# EAGLE design mainboard (EAGLE 7.7.0)
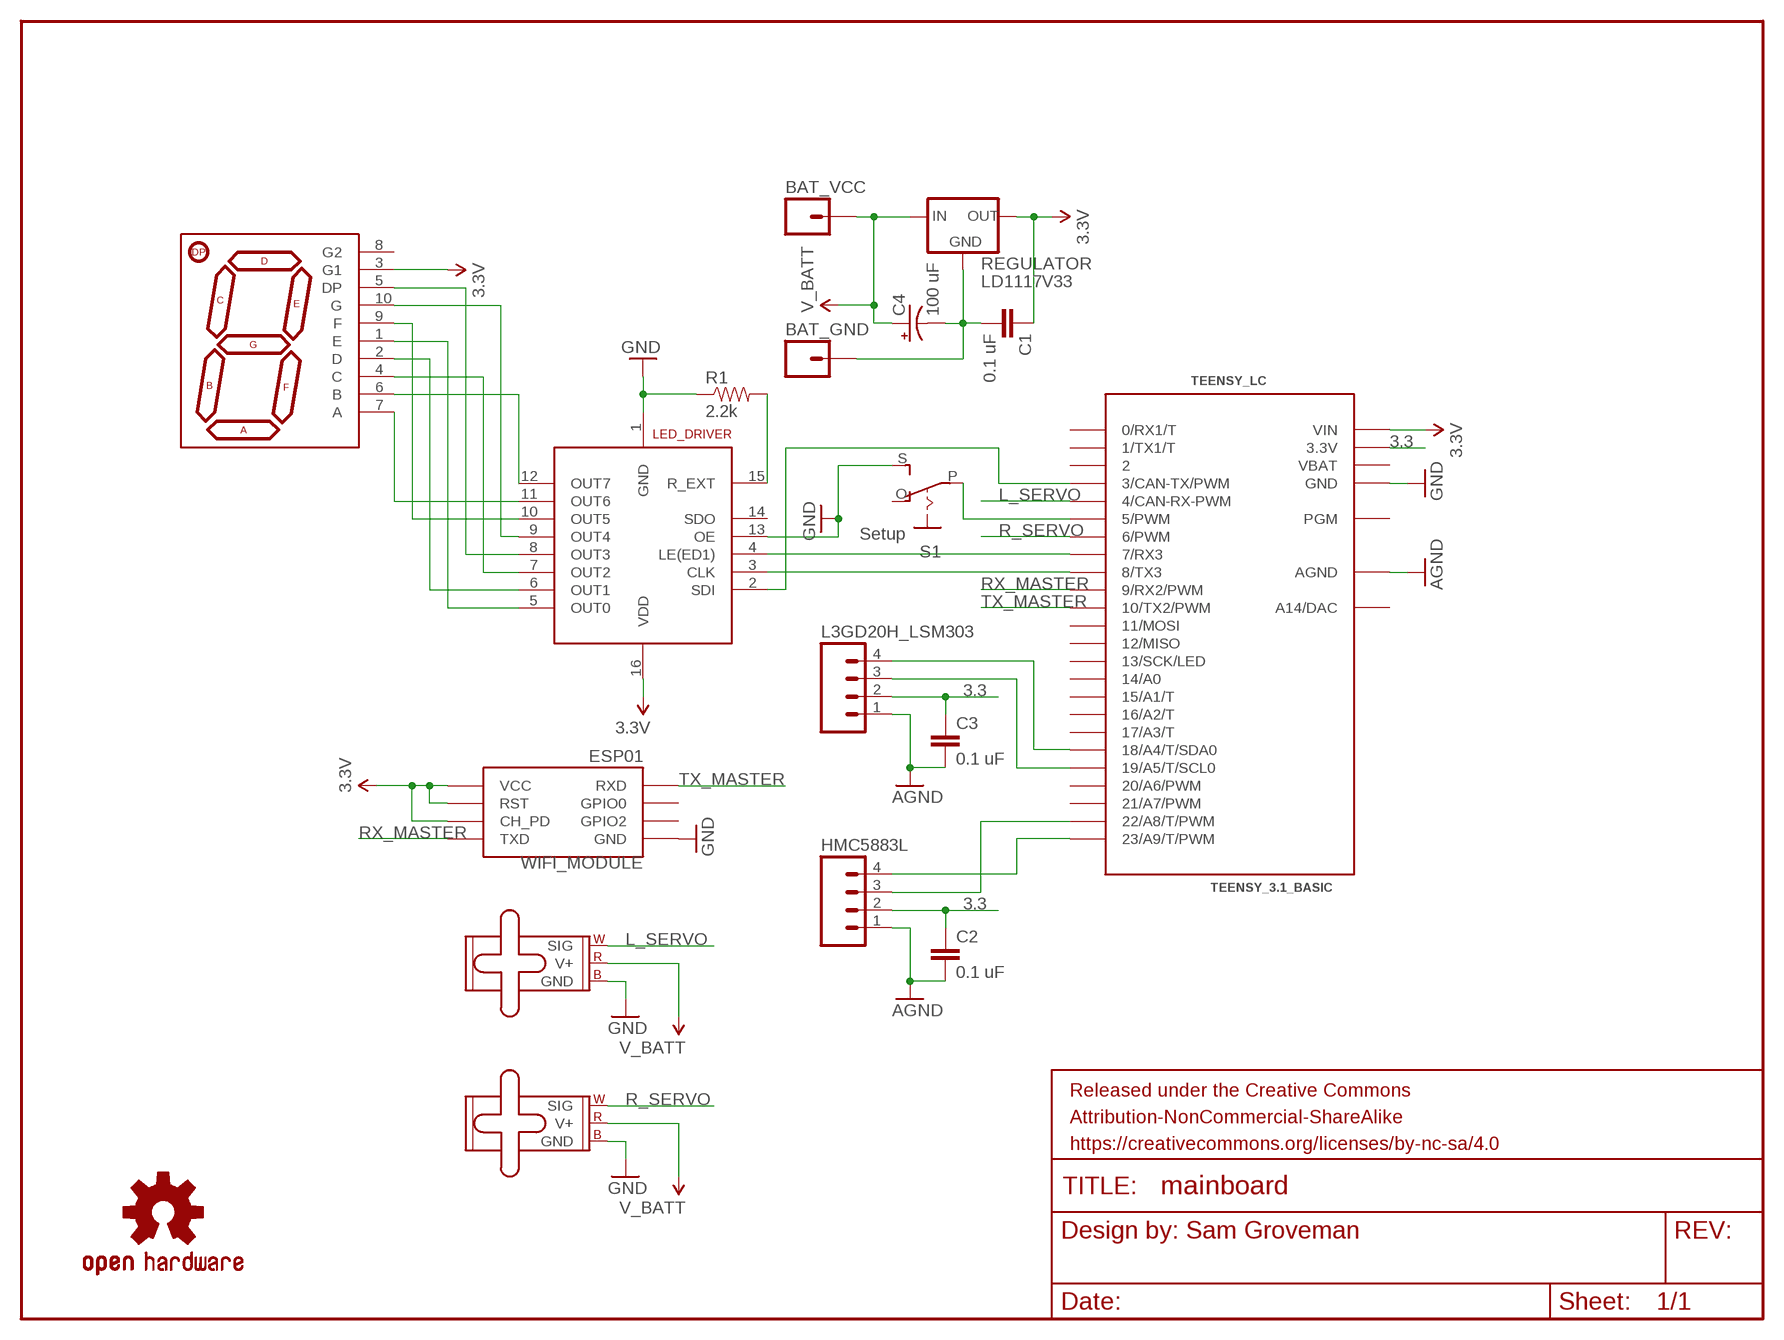
[diagram p0: schematic, sheet 1]

## Parts
BAT_GND  M01PTH  [1X01]
BAT_VCC  M01PTH  [1X01]
C1  0.1 uF  CAPPTH  [CAP-PTH-SMALL]
C2  0.1 uF  CAPPTH  [CAP-PTH-SMALL]
C3  0.1 uF  CAPPTH  [CAP-PTH-SMALL]
C4  100 uF  CAP_POLPTH1  [CPOL-RADIAL-100UF-25V]
FRAME1  FRAME-LETTER  [CREATIVE_COMMONS]
HMC5883L  M04PTH  [1X04]
L3GD20H_LSM303  M04PTH  [1X04]
L_SERVO  SMALL_SERVO  [1X03]
LED_DRIVER  TLC5916/17DIP-16  [DIP-16]
LOGO1  OSHW-LOGOL  [OSHW-LOGO-L]
R1  2.2k  RESISTORPTH-1/4W  [AXIAL-0.4]
R_SERVO  SMALL_SERVO  [1X03]
REGULATOR  LD1117V33  [LD1117V33]
S1  Setup  EG1218S  [EG1218]
TEENSY_LC  TEENSY_3.1_BASIC  [TEENSY_3.1_BASIC]
U$4  7-SEGMENT-DISPLAY-1"-RED  [7-SEGMENT-1"PTH]
WIFI_MODULE  ESP01  [ESP01]

## Nets
3.3: C2.1 C3.1 HMC5883L.2 L3GD20H_LSM303.2 TEENSY_LC.3.3V TEENSY_LC.3.3V1(3.3V)
3.3V: C1.1 LED_DRIVER.16(VDD) REGULATOR.OUT TEENSY_LC.VIN U$4.3(G1) WIFI_MODULE.CH_PD WIFI_MODULE.RST WIFI_MODULE.VCC
AGND: C2.2 C3.2 HMC5883L.1 L3GD20H_LSM303.1 TEENSY_LC.AGND
CLK: LED_DRIVER.3(CLK) TEENSY_LC.8(8/TX3)
F_SCL: HMC5883L.3 TEENSY_LC.22/A8(22/A8/T/PWM)
F_SDA: HMC5883L.4 TEENSY_LC.23/A9(23/A9/T/PWM)
GND: BAT_GND.1 C1.2 C4.2(-) L_SERVO.3(GND) LED_DRIVER.1(GND) LED_DRIVER.13(OE) R1.P$1 R_SERVO.3(GND) REGULATOR.GND S1.S TEENSY_LC.GND TEENSY_LC.GND1(GND) WIFI_MODULE.GND
L_SERVO: L_SERVO.1(SIG) TEENSY_LC.4(4/CAN-RX-PWM)
LE: LED_DRIVER.4(LE(ED1)) TEENSY_LC.7(7/RX3)
LED_1: LED_DRIVER.5(OUT0) U$4.1(E)
LED_2: LED_DRIVER.6(OUT1) U$4.2(D)
LED_4: LED_DRIVER.7(OUT2) U$4.4(C)
LED_5: LED_DRIVER.8(OUT3) U$4.5(DP)
LED_6: LED_DRIVER.12(OUT7) U$4.6(B)
LED_7: LED_DRIVER.11(OUT6) U$4.7(A)
LED_9: LED_DRIVER.10(OUT5) U$4.9(F)
LED_10: LED_DRIVER.9(OUT4) U$4.10(G)
R_EXT: LED_DRIVER.15(R_EXT) R1.P$2
R_SCL: L3GD20H_LSM303.3 TEENSY_LC.19/A5(19/A5/T/SCL0)
R_SDA: L3GD20H_LSM303.4 TEENSY_LC.18/A4(18/A4/T/SDA0)
R_SERVO: R_SERVO.1(SIG) TEENSY_LC.6(6/PWM)
RX_MASTER: TEENSY_LC.9(9/RX2/PWM) WIFI_MODULE.TX(TXD)
SDI: LED_DRIVER.2(SDI) TEENSY_LC.3(3/CAN-TX/PWM)
SETUP: S1.P TEENSY_LC.5(5/PWM)
TX_MASTER: TEENSY_LC.10(10/TX2/PWM) WIFI_MODULE.RX(RXD)
V_BATT: BAT_VCC.1 C4.1(+) L_SERVO.2(V+) R_SERVO.2(V+) REGULATOR.IN
Unconnected: LED_DRIVER.14(SDO) S1.O TEENSY_LC.0(0/RX1/T) TEENSY_LC.1(1/TX1/T) TEENSY_LC.2 TEENSY_LC.11(11/MOSI) TEENSY_LC.12(12/MISO) TEENSY_LC.13(13/SCK/LED) TEENSY_LC.14/A0 TEENSY_LC.15/A1(15/A1/T) TEENSY_LC.16/A2(16/A2/T) TEENSY_LC.17/A3(17/A3/T) TEENSY_LC.20/A6(20/A6/PWM) TEENSY_LC.21/A7(21/A7/PWM) TEENSY_LC.A14(A14/DAC) TEENSY_LC.PGM U$4.8(G2) WIFI_MODULE.GPIO0 WIFI_MODULE.GPIO2

## Power pins joined to a net without a drawn wire
VBAT: TEENSY_LC.VBAT

## Library data of the parts
BAT_GND BAT_VCC = SparkFun-Connectors:M01: Header 1 Standard 1-pin 0.1" header. Use with straight break away headers (SKU : PRT-00116), right angle break away headers (PRT-00553), swiss pins (PRT-00743), machine pins (PRT-00117), and female headers (PRT-00115).
C1-C3 = SparkFun-Passives:CAP: Capacitor Standard 0603 ceramic capacitor, and 0.1" leaded capacitor.
C4 = SparkFun-Passives:CAP_POL: Capacitor Polarized These are standard SMD and PTH capacitors. Normally 10uF, 47uF, and 100uF in electrolytic and tantalum varieties. Always verify the external diameter of the through hole cap, it varies with capacity, voltage, and manufacturer. The EIA devices should be standard.
FRAME1 = SparkFun-Aesthetics:FRAME-LETTER: Schematic Frame Standard 8.5x11 US Letter frame
HMC5883L L3GD20H_LSM303 = SparkFun-Connectors:M04: Header 4 Standard 4-pin 0.1" header. Use with straight break away headers (SKU : PRT-00116), right angle break away headers (PRT-00553), swiss pins (PRT-00743), machine pins (PRT-00117), and female headers (PRT-00115). Molex polarized connector foot print use with SKU : PRT-08231 with associated crimp pins and housings. 1MM SMD Version SKU: PRT-10208
L_SERVO R_SERVO = SparkFun-Electromechanical:SMALL_SERVO: Small servo motor This is the small servo used in the SIK. SKU: ROB-09065
LED_DRIVER = BillPorter:TLC5916/17: TLC5916/17 8-Channel Constant-Current LED Sink Driver and Shift Register in one. Great for driving high current LEDs that would kill a 595 shift register. Specs @ http://focus.ti.com/docs/prod/folders/print/tlc5916.html
LOGO1 = SparkFun-Aesthetics:OSHW-LOGO: Open Source Hardware Logo This logo indicates the piece of hardware it is found on incorporates a OSHW license and/or adheres to the definition of open source hardware found here: http://freedomdefined.org/OSHW
R1 = SparkFun-Passives:RESISTOR: Resistor Basic schematic elements and footprints for 0603, 1206, and PTH resistors.
REGULATOR = LD1117V33:LD1117V33
S1 = adafruit:EG1218: SLIDING SWITCH 0.1" spacing through hole, vertical SPDT slide switch http://www.ladyada.net/library/pcb/eaglelibrary.html
TEENSY_LC = Teensy_3_Series_Board_v1.0:TEENSY_3.1_BASIC: Footprint for Teensy 3.1 board using all pin connections on the outer perimeter
U$4 = SparkFun-Displays:7-SEGMENT-DISPLAY-1"-RED: 7-Segment Display 1" Red (COM-08546) EZ is for kits. Pads are only exposed on the bottom side to help prevent soldering in upside down.
WIFI_MODULE = esp8266modules:ESP01: ESP8266 Wifi module 01

## Board
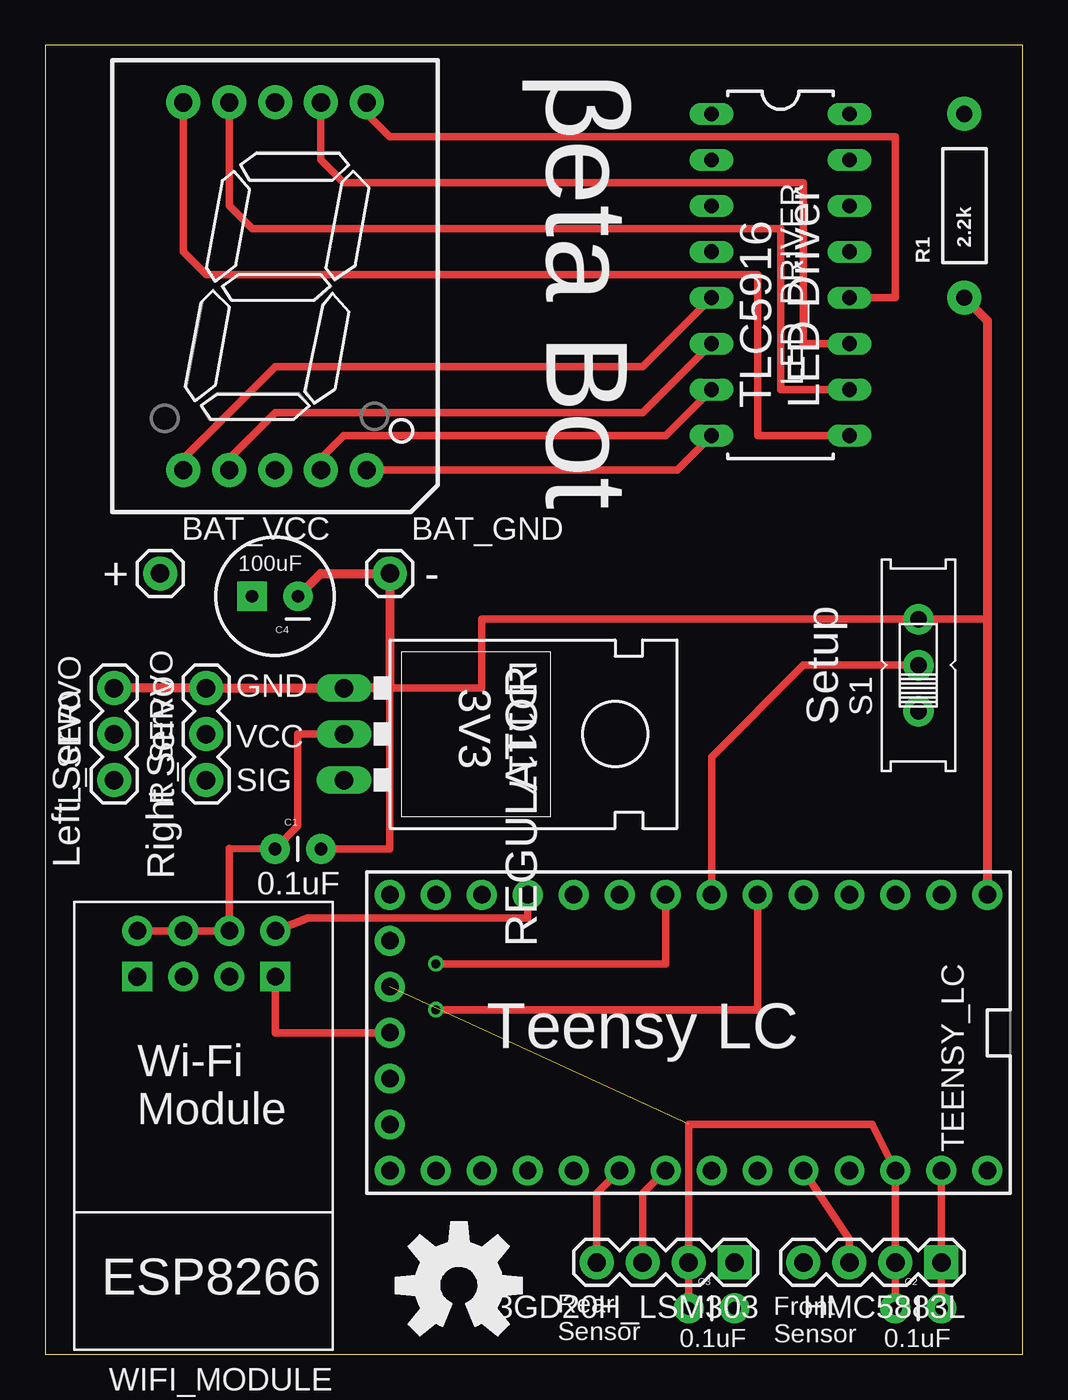
[diagram p1: board, top side]
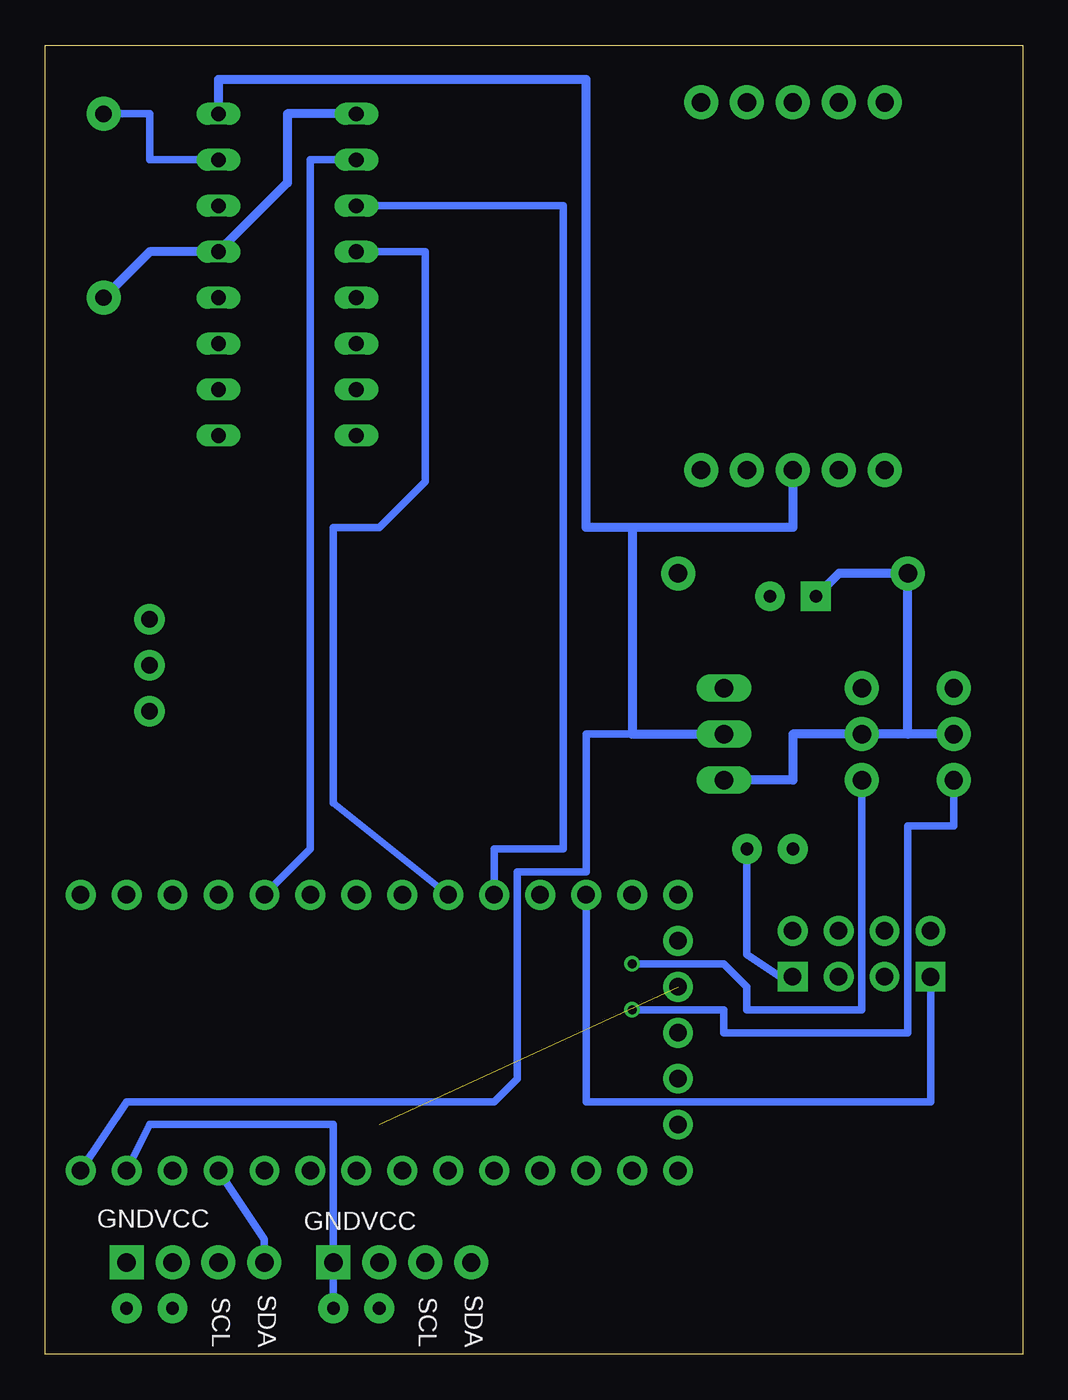
[diagram p2: board, bottom side, seen from below]

Size 54.03 x 72.38 mm. Coordinates in mm from the lower left corner, seen from the top.
Outline: 0,0 54.03,0 54.03,72.38 0,72.38 0,0
Copper layers (1*16): Top 0.0356mm / dielectric 1.5011mm / Bottom 0.0356mm
Design rules "oshpark-2layer *": minimum track width 6mil, minimum drill 13mil, track to track 6mil, track to pad 6mil, pad to pad 6mil, via to via 6mil, smd to smd 6mil, copper to edge 15mil, drill to drill 6mil, minimum pad ring 7mil, minimum via ring 7mil, stop-mask expansion 2.5mil, vias tented up to drill 35mil, thermal gap 10mil

### Footprints (pad centres in the part's own frame; a part is rotated, then mirrored left to right if it is on the bottom)
1X01 = drill 1.016 pad 1.88: 1 0,0
CAP-PTH-SMALL = drill 0.7 pad 1.651: 1 0,0; 2 2.54,0
CPOL-RADIAL-100UF-25V = drill 0.7 pad 1.651 square: 1 1.27,0 | drill 0.7 pad 1.651: 2 -1.27,0
1X04 = drill 1.016 pad 1.88 square: 1 0,0 | drill 1.016 pad 1.88: 2 2.54,0; 3 5.08,0; 4 7.62,0
1X03 = drill 1.016 pad 1.88: 1 0,0; 2 2.54,0; 3 5.08,0
DIP-16 = drill 0.813 long: 1 -8.89,-3.81; 2 -6.35,-3.81; 3 -3.81,-3.81; 4 -1.27,-3.81; 5 1.27,-3.81; 6 3.81,-3.81; 7 6.35,-3.81; 8 8.89,-3.81; 9 8.89,3.81; 10 6.35,3.81; 11 3.81,3.81; 12 1.27,3.81; 13 -1.27,3.81; 14 -3.81,3.81; 15 -6.35,3.81; 16 -8.89,3.81
AXIAL-0.4 = drill 0.9 pad 1.88: P$1 -5.08,0; P$2 5.08,0
LD1117V33 = drill 1.016 long: GND -2.54,-8.89; IN 2.54,-8.89; OUT 0,-8.89
EG1218 = drill 0.9 pad 1.676: O -2.54,0; P 0,0; S 2.54,0
TEENSY_3.1_BASIC = drill 0.965 pad 1.651: 0 -7.62,13.97; 1 -7.62,11.43; 2 -7.62,8.89; 3 -7.62,6.35; 3.3V 7.62,11.43; 3.3V1 -2.54,-16.51; 4 -7.62,3.81; 5 -7.62,1.27; 6 -7.62,-1.27; 7 -7.62,-3.81; 8 -7.62,-6.35; 9 -7.62,-8.89; 10 -7.62,-11.43; 11 -7.62,-13.97; 12 -7.62,-16.51; 13 7.62,-16.51; 14/A0 7.62,-13.97; 15/A1 7.62,-11.43; 16/A2 7.62,-8.89; 17/A3 7.62,-6.35; 18/A4 7.62,-3.81; 19/A5 7.62,-1.27; 20/A6 7.62,1.27; 21/A7 7.62,3.81; 22/A8 7.62,6.35; 23/A9 7.62,8.89; A14 5.08,-16.51; AGND 7.62,13.97; GND -7.62,16.51; GND1 0,-16.51; PGM 2.54,-16.51; VBAT -5.08,-16.51; VIN 7.62,16.51
7-SEGMENT-1"PTH = drill 1 pad 1.88: 1 -5.08,-10.16; 2 -2.54,-10.16; 3 0,-10.16; 4 2.54,-10.16; 5 5.08,-10.16; 6 5.08,10.16; 7 2.54,10.16; 8 0,10.16; 9 -2.54,10.16; 10 -5.08,10.16
ESP01 = drill 0.965 pad 1.651: CH_PD -1.285,-8.178; GPIO0 1.255,-5.638; GPIO2 -1.285,-5.638; RST 1.255,-8.178; TX -3.825,-8.178; VCC 3.795,-8.178 | drill 0.965 pad 1.651 square: GND -3.825,-5.638 | drill 0.991 pad 1.651 square: RX 3.795,-5.638

### Placement (x,y rotation side)
BAT_GND  19.05,43.18 0 top
BAT_VCC  6.35,43.18 0 top
C1  12.7,27.94 0 top
C2  46.99,2.54 0 top
C3  35.56,2.54 0 top
C4  12.7,41.91 180 top
FRAME1  -5.08,74.93 0 top  (outside the outline)
HMC5883L  49.53,5.08 180 top
L3GD20H_LSM303  38.1,5.08 180 top
L_SERVO  3.81,31.75 90 top
LED_DRIVER  40.64,59.69 270 top
LOGO1  22.86,3.81 0 top
R1  50.8,63.5 90 top
R_SERVO  8.89,31.75 90 top
REGULATOR  25.4,34.29 270 top
S1  48.26,38.1 90 top
TEENSY_LC  35.56,17.78 270 top
U$4  12.7,59.05 0 top
WIFI_MODULE  8.89,15.24 180 top

### Tracks (layer width: path | path; a pad name or v marks a point on that pad's centre or on a via)
3.3  (1 unrouted)
  Top 0.406: C2.1 HMC5883L.2 TEENSY_LC.3.3V 45.72,12.7 35.56,12.7 L3GD20H_LSM303.2 C3.1
3.3V
  Top 0.406: WIFI_MODULE.VCC WIFI_MODULE.RST WIFI_MODULE.CH_PD 10.18,27.95 C1.1 13.97,29.21 13.97,34.29 REGULATOR.OUT
  Bottom 0.406: TEENSY_LC.VIN 49.53,13.97 29.21,13.97 27.94,15.24 27.94,26.67 24.13,26.67 24.13,34.29 21.59,34.29
  Bottom 0.508: REGULATOR.OUT 21.59,34.29 21.59,45.72 | U$4.3 12.7,45.72 21.59,45.72 | 21.59,45.72 24.13,45.72 24.13,70.48 44.45,70.48 LED_DRIVER.16
AGND
  Top 0.406: TEENSY_LC.AGND HMC5883L.1 C2.2
  Bottom 0.406: C3.2 L3GD20H_LSM303.1 38.1,12.7 48.26,12.7 TEENSY_LC.AGND
CLK
  Bottom 0.406: LED_DRIVER.3 25.4,63.5 25.4,27.94 29.21,27.94 TEENSY_LC.8
F_SCL
  Top 0.406: HMC5883L.3 44.45,6.35 TEENSY_LC.22/A8
F_SDA
  Bottom 0.406: TEENSY_LC.23/A9 41.91,6.35 HMC5883L.4
GND
  Top 0.406: 52.03,40.6 52.07,40.64 S1.S 44.41,40.64 43.18,40.64 24.13,40.64 24.13,36.83 19.05,36.83 19.05,27.94 C1.2 | TEENSY_LC.GND1 12.7,17.78 12.7,20.86 WIFI_MODULE.GND
  Top 0.508: L_SERVO.3 R_SERVO.3 REGULATOR.GND 19.05,36.83 BAT_GND.1 15.24,43.18 C4.2 | TEENSY_LC.GND 52.07,40.64 52.07,57.15 R1.P$1
  Bottom 0.406: WIFI_MODULE.GND 13.41,20.88 15.24,22.1 C1.2
  Bottom 0.508: LED_DRIVER.1 40.64,68.58 40.64,64.77 LED_DRIVER.13 48.26,60.96 R1.P$1
L_SERVO  (via drill 0.5)
  Top 0.406: v21.59,19.05 39.37,19.05 TEENSY_LC.4
  Bottom 0.406: L_SERVO.1 3.81,29.21 6.35,29.21 6.35,17.78 16.51,17.78 16.51,19.05 v21.59,19.05
LE
  Bottom 0.406: LED_DRIVER.4 33.02,60.96 33.02,48.26 35.56,45.72 38.1,45.72 38.1,30.48 TEENSY_LC.7
LED_1
  Top 0.406: U$4.1 7.62,49.53 12.7,54.61 33.02,54.61 LED_DRIVER.5
LED_2
  Top 0.406: U$4.2 10.16,49.53 12.7,52.07 33.02,52.07 LED_DRIVER.6
LED_4
  Top 0.406: U$4.4 15.24,49.53 16.51,50.8 34.29,50.8 LED_DRIVER.7
LED_5
  Top 0.406: U$4.5 34.92,48.9 LED_DRIVER.8
LED_6
  Top 0.406: LED_DRIVER.12 46.99,58.42 46.99,67.31 19.05,67.31 17.78,68.58 U$4.6
LED_7
  Top 0.406: LED_DRIVER.11 41.91,55.88 41.91,64.77 16.51,64.77 15.24,66.04 U$4.7
LED_9
  Top 0.406: LED_DRIVER.10 40.64,53.34 40.64,62.23 11.43,62.23 10.16,63.5 U$4.9
LED_10
  Top 0.406: LED_DRIVER.9 39.37,50.8 39.37,59.69 8.89,59.69 7.62,60.96 U$4.10
R_EXT
  Bottom 0.406: LED_DRIVER.15 48.26,66.04 48.26,68.58 R1.P$2
R_SCL
  Top 0.406: TEENSY_LC.19/A5 33.02,8.89 L3GD20H_LSM303.3
R_SDA
  Top 0.406: TEENSY_LC.18/A4 30.48,8.89 L3GD20H_LSM303.4
R_SERVO  (via drill 0.5)
  Top 0.406: v21.59,21.59 34.29,21.59 TEENSY_LC.6
  Bottom 0.406: R_SERVO.1 8.89,19.05 15.24,19.05 15.24,20.32 16.51,21.59 v21.59,21.59
RX_MASTER
  Top 0.406: TEENSY_LC.9 26.67,24.13 14.54,24.13 WIFI_MODULE.TX
SDI
  Bottom 0.406: LED_DRIVER.2 39.37,66.04 39.37,27.94 TEENSY_LC.3
SETUP
  Top 0.406: TEENSY_LC.5 36.83,33.02 41.91,38.1 S1.P
TX_MASTER
  Bottom 0.406: TEENSY_LC.10 24.13,13.97 5.08,13.97 5.08,20.86 WIFI_MODULE.RX
V_BATT
  Bottom 0.508: 6.35,34.29 R_SERVO.2 12.7,34.29 12.7,31.75 REGULATOR.IN | L_SERVO.2 6.35,34.29 | 6.35,34.29 BAT_VCC.1 10.16,43.18 C4.1

### Text on the board
tPlace: βeta Bot | TLC5916 / LED Driver | 100uF | + | - | LD1117 | 3V3 | GND | Setup | VCC | SIG | Left Servo | Right Servo | 0.1uF | Teensy LC | Wi-Fi / Module | Rear / Sensor | Front / Sensor | 0.1uF | 0.1uF
bPlace: VCC | GND | VCC | GND | SDA | SCL | SDA | SCL